# Altium schematic sheet Heracles Nadir Panel.SchDoc: Heracles Nadir Panel
size Letter; Author: Nicholas J Sorensen; CompanyName: AlbertaSat; Engineer: Nicholas J Sorensen; DocumentNumber: 1; SheetNumber: 1; SheetTotal: 4; CopyrightYear: 2019
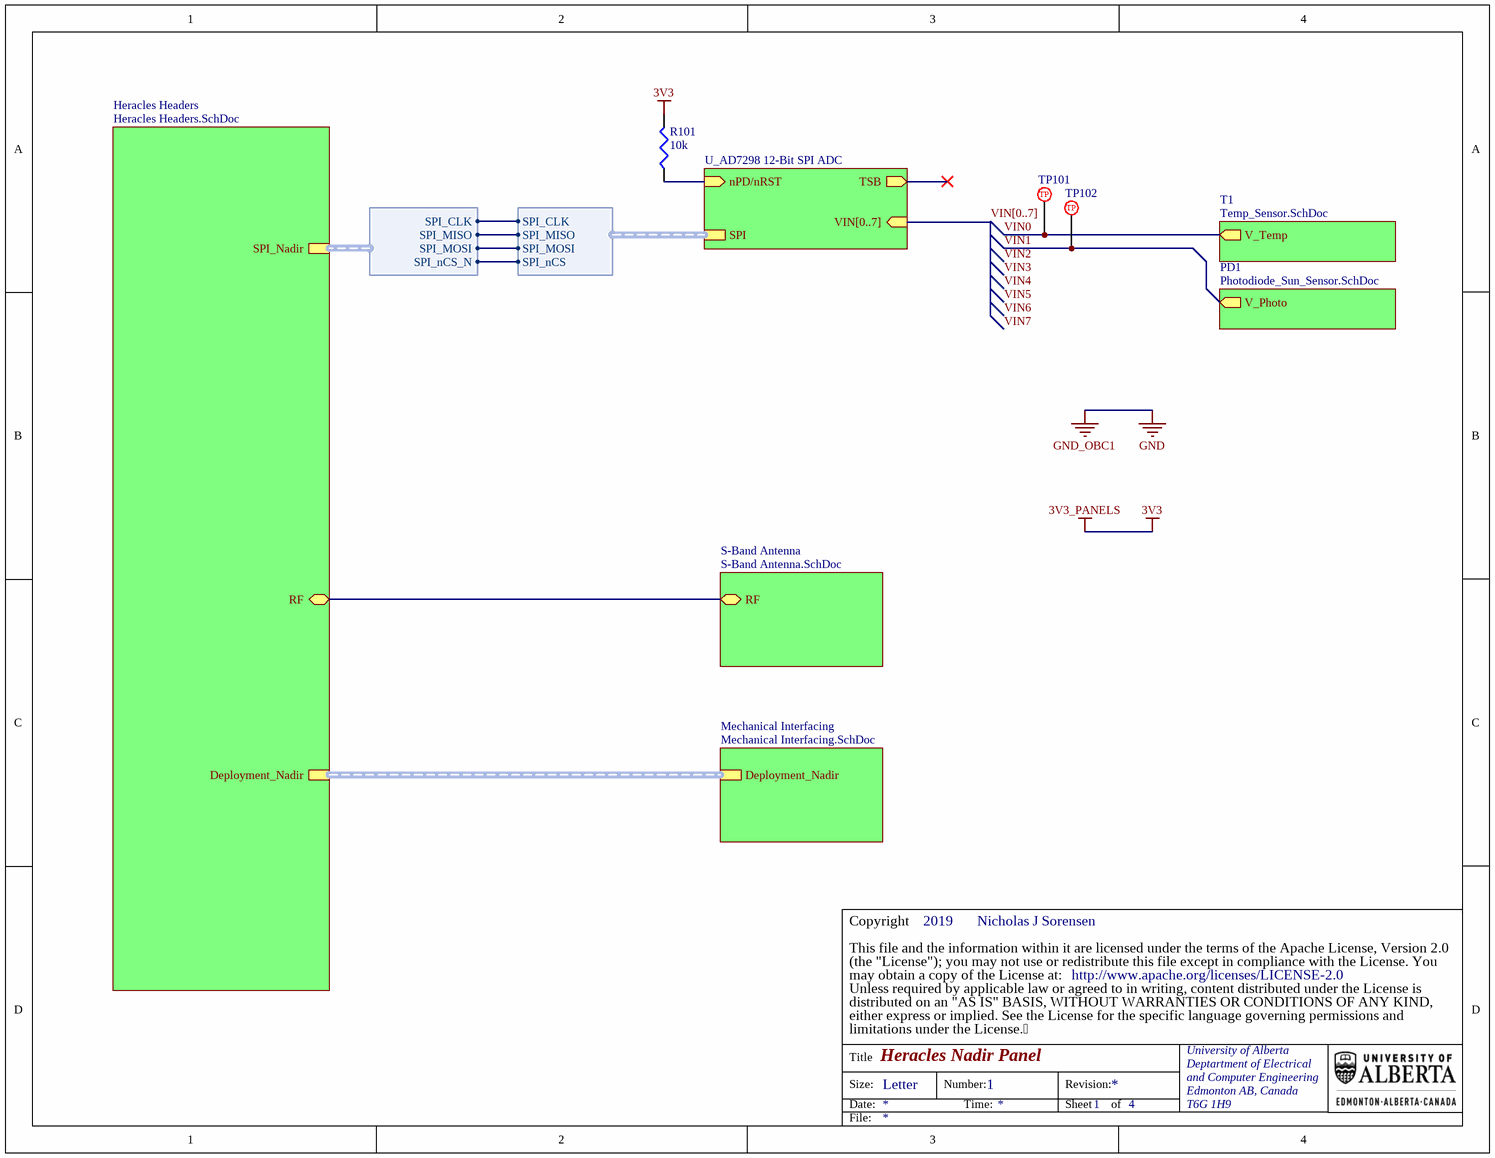
[diagram p0: Heracles Nadir Panel.SchDoc]

## Parts
R101  value 10k  [VSH-0603MCT]  (hidden comment: Res3)
TP101  5017  [KS-5017]  (value not drawn)
TP102  5017  [KS-5017]  (value not drawn)

## Sub-sheets
Heracles Headers = Heracles Headers.SchDoc: RF (bidir), SPI_Nadir (harness SPI_Nadir), Deployment_Nadir
Mechanical Interfacing = Mechanical Interfacing.SchDoc: Deployment_Nadir
PD1 = Photodiode_Sun_Sensor.SchDoc: V_Photo (out)
S-Band Antenna = S-Band Antenna.SchDoc: RF (bidir)
T1 = Temp_Sensor.SchDoc: V_Temp (out)
U_AD7298 12-Bit SPI ADC = AD7298 12-Bit SPI ADC.SchDoc: nPD/nRST (in), TSB (out), VIN[0..7] (in), SPI (harness AD7298_SPI)

## Harnesses
AD7298_SPI: SPI_CLK, SPI_MISO, SPI_MOSI, SPI_nCS
SPI_Nadir: SPI_CLK, SPI_MISO, SPI_MOSI, SPI_nCS_N

## Nets
3V3: R101.2  [also labelled 3V3_PANELS]
VIN0: TP101.1 ; sheet T1/V_Temp
VIN1: TP102.1 ; sheet PD1/V_Photo
NetR101_1: R101.1 ; sheet U_AD7298 12-Bit SPI ADC/nPD/nRST
(unnamed): sheet Heracles Headers/RF, sheet S-Band Antenna/RF
(unnamed): sheet U_AD7298 12-Bit SPI ADC/SPI.SPI_CLK, sheet Heracles Headers/SPI_Nadir.SPI_CLK
(unnamed): sheet U_AD7298 12-Bit SPI ADC/SPI.SPI_MISO, sheet Heracles Headers/SPI_Nadir.SPI_MISO
(unnamed): sheet U_AD7298 12-Bit SPI ADC/SPI.SPI_MOSI, sheet Heracles Headers/SPI_Nadir.SPI_MOSI
(unnamed): sheet U_AD7298 12-Bit SPI ADC/SPI.SPI_nCS, sheet Heracles Headers/SPI_Nadir.SPI_nCS_N

## Buses and harness runs
bus VIN[0..7] = sheet U_AD7298 12-Bit SPI ADC/VIN[0..7]
harness sheet Heracles Headers/Deployment_Nadir = sheet Mechanical Interfacing/Deployment_Nadir

## Notes on the sheet
- Labels drawn without touching a wire or pin: VIN2, VIN3, VIN4, VIN5, VIN6, VIN7
- (the "License"); you may not use or redistribute this file except in compliance with the License. You
- This file and the information within it are licensed under the terms of the Apache License, Version 2.0
- Copyright
- Unless required by applicable law or agreed to in writing, content distributed under the License is
- distributed on an "AS IS" BASIS, WITHOUT WARRANTIES OR CONDITIONS OF ANY KIND,
- either express or implied. See the License for the specific language governing permissions and
- limitations under the License.
- may obtain a copy of the License at:
- http://www.apache.org/licenses/LICENSE-2.0
- Title
- Size:
- Date:
- Letter
- Number:
- Time:
- Revision:
- Sheet
- of
- University of Alberta
- Deptartment of Electrical
- and Computer Engineering
- Edmonton AB, Canada
- T6G 1H9
- File:
- (in symbol PTP-KS-00001) TP

## Library data of the parts
R101 = PR-VSH-00143: RES SMD 10K OHM 1% 1/8W 0603; Manufacturer Part Number: MCT06030C1002FP500; Index: 143; Designator: R?; Temperature Coefficient: ±50ppm/°C; Published: 3/14/2016; LatestRevisionDate: 3/14/2016; LatestRevisionNote: ...; PackageReference: 0603 (1608 Metric); Publisher: AlbertaSat; PackageDescription: Chip Resistor, 2-Leads, Body 1.55x0.85mm, IPC Low Density; Part Number: PR-VSH-00143; Supplier Part Number 1: MCT0603-10.0K-CFCT-ND; Supplier 1: Digi-key; Supplier Link: http://www.digikey.ca/product-search/en?keywords=MCT0603-10.0K-CFCT-ND; Tolerance: ±1%; Power - Rated: 1/8W; Applications: General Purpose
TP101 TP102 = PTP-KS-00001: PC TEST POINT MINI SMD; Index: 1; Supplier 1: Digi-key; Supplier 2: Newark; Supplier 3: Mouser; Part Number: PTP-KS-00001; Manufacturer Part Number: 5017; Supplier Part Number 1: 36-5017CT-ND; Publisher: AlbertaSat; Published: 3/15/2016; LatestRevisionDate: 3/15/2016; LatestRevisionNote: ...; PackageReference: KS-5017; PackageDescription: Testpoint Lug Mini SMD 27X10X152; Supplier Link: http://www.digikey.ca/product-detail/en/keystone-electronics/5017/36-5017TR-ND/2217304